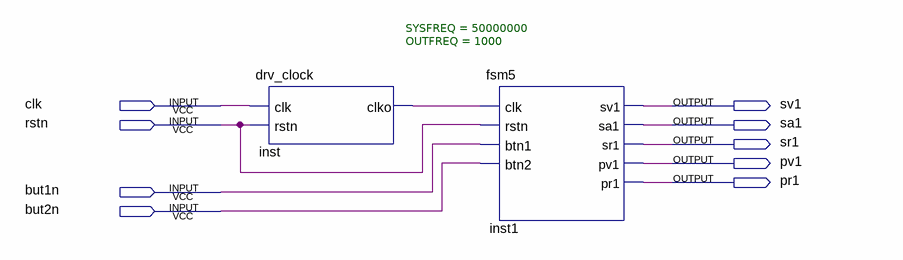
[diagram p0: schematic sheet]
// Quartus schematic dig2lab5.bdf as structural Verilog: 2 symbols, 9 pins
module dig2lab5 (
  input  clk,
  input  rstn,
  input  but1n,
  input  but2n,
  output sv1,
  output sa1,
  output sr1,
  output pv1,
  output pr1
);

  wire inst_clko;

  drv_clock #(.SYSFREQ(50000000), .OUTFREQ(1000)) inst (.clk(clk), .rstn(rstn), .clko(inst_clko));
  fsm5 inst1 (
    .clk(inst_clko), .rstn(rstn), .btn1(but1n), .btn2(but2n), .sv1(sv1), .sa1(sa1), .sr1(sr1), .pv1(pv1),
    .pr1(pr1));
endmodule
